# Altium schematic sheet Table_of_Contents.SchDoc
size A; SheetNumber: 1; SheetTotal: 16
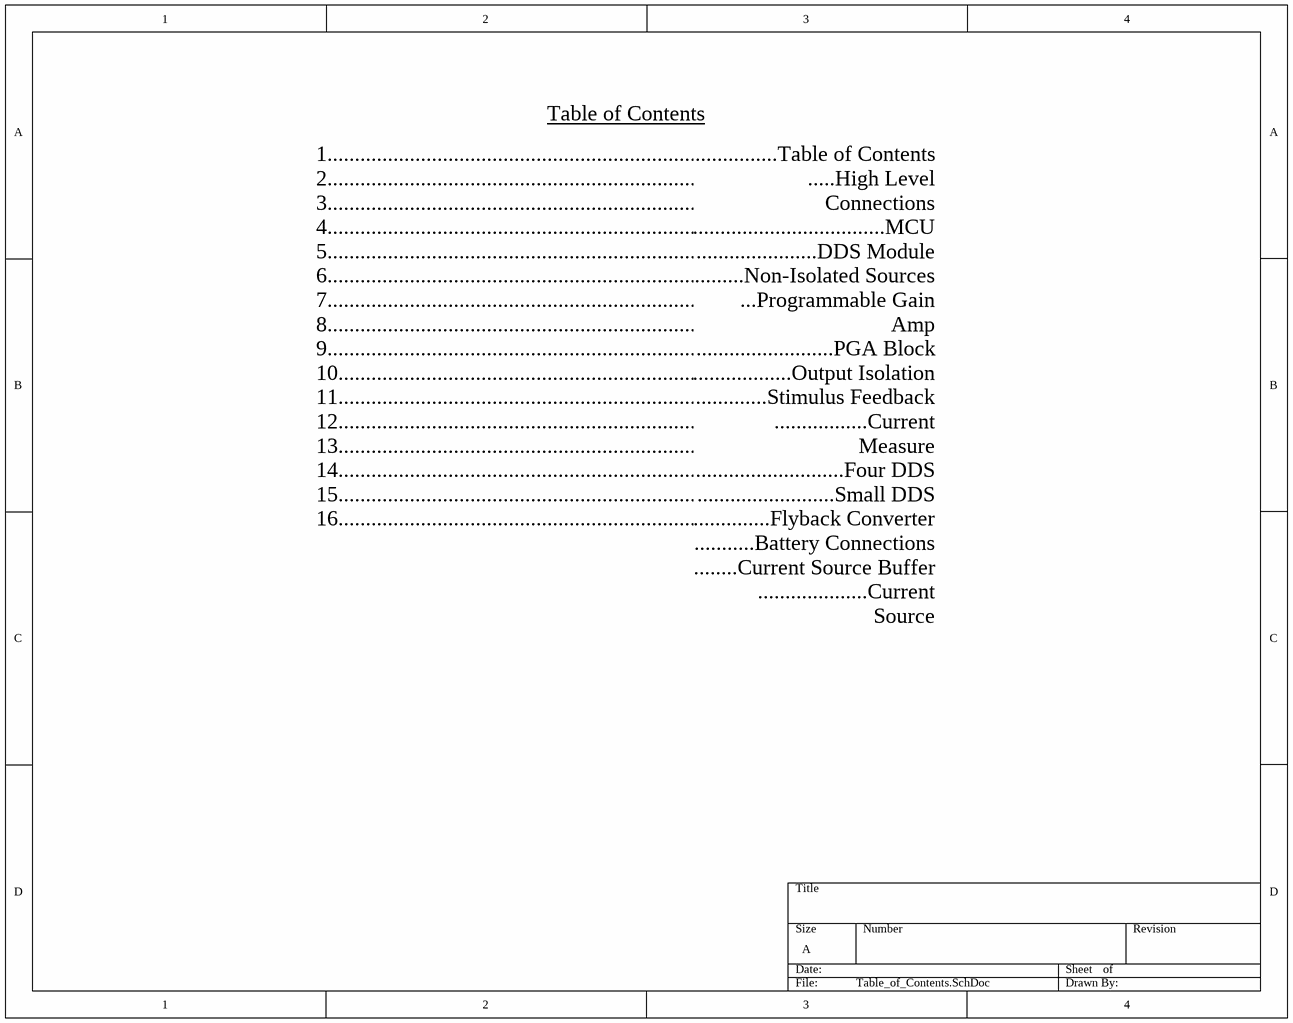
[diagram p0: Table_of_Contents.SchDoc]

## Sub-sheets
U_High_Level_Connections = High_Level_Connections.SchDoc: no entries

## Notes on the sheet
- Table of Contents
- 1...........................................................................................................
  2...........................................................................................................
  3...........................................................................................................
  4...........................................................................................................
  5...........................................................................................................
  6...........................................................................................................
  7...........................................................................................................
  8...........................................................................................................
  9...........................................................................................................
  10.........................................................................................................
  11.........................................................................................................
  12.........................................................................................................
  13.........................................................................................................
  14.........................................................................................................
  15.........................................................................................................
  16.........................................................................................................
- ...............Table of Contents
  .....High Level Connections
  ...................................MCU
  ......................DDS Module
  .........Non-Isolated Sources
  ...Programmable Gain Amp
  .........................PGA Block
  ..................Output Isolation
  .............Stimulus Feedback
  .................Current Measure
  ...........................Four DDS
  .........................Small DDS
  ..............Flyback Converter
  ...........Battery Connections
  ........Current Source Buffer
  ....................Current Source